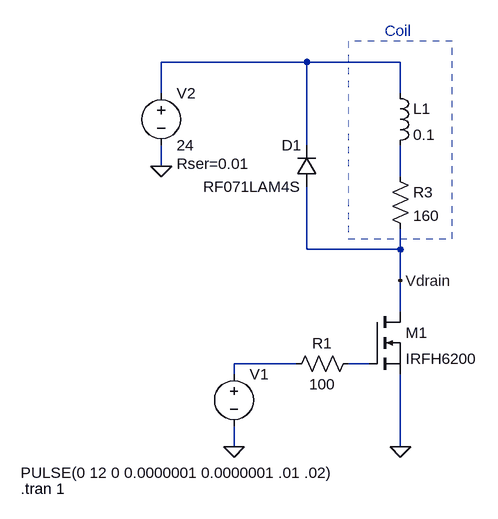
[diagram p0: schematic diode.asc]
diode.asc, the LTspice schematic file:
Version 4
SHEET 1 1004 680
WIRE 96 -48 -128 -48
WIRE 240 -48 96 -48
WIRE -128 0 -128 -48
WIRE 240 0 240 -48
WIRE 96 80 96 -48
WIRE -128 112 -128 80
WIRE 240 128 240 80
WIRE 96 240 96 144
WIRE 240 240 240 208
WIRE 240 240 96 240
WIRE 240 288 240 240
WIRE 240 336 240 288
WIRE 80 416 -16 416
WIRE 192 416 160 416
WIRE -16 432 -16 416
WIRE -16 544 -16 512
WIRE 240 544 240 432
FLAG -16 544 0
FLAG 240 544 0
FLAG -128 112 0
FLAG 240 288 Vdrain
SYMBOL nmos 192 336 R0
SYMATTR InstName M1
SYMATTR Value IRFH6200
SYMBOL res 176 400 R90
WINDOW 0 0 56 VBottom 2
WINDOW 3 32 56 VTop 2
SYMATTR InstName R1
SYMATTR Value 100
SYMBOL voltage -16 416 R0
WINDOW 3 -328 168 Left 2
WINDOW 123 0 0 Left 0
WINDOW 39 0 0 Left 0
SYMATTR Value PULSE(0 12 0 0.0000001 0.0000001 .01 .02)
SYMATTR InstName V1
SYMBOL ind 224 -16 R0
SYMATTR InstName L1
SYMATTR Value 0.1
SYMBOL voltage -128 -16 R0
WINDOW 123 0 0 Left 0
WINDOW 39 24 124 Left 2
SYMATTR SpiceLine Rser=0.01
SYMATTR InstName V2
SYMATTR Value 24
SYMBOL res 224 112 R0
SYMATTR InstName R3
SYMATTR Value 160
SYMBOL diode 112 144 R180
WINDOW 0 24 64 Left 2
WINDOW 3 24 0 Left 2
SYMATTR InstName D1
SYMATTR Value RF071LAM4S
TEXT -344 608 Left 2 !.tran 1
TEXT 216 -96 Left 2 ;Coil
LINE Normal 320 -80 160 -80 2
LINE Normal 320 224 320 -80 2
LINE Normal 160 224 320 224 2
LINE Normal 160 -80 160 224 2

The netlist it stands for:
* diode.asc
M1 Vdrain N004 0 0 IRFH6200
R1 N004 N003 100
V1 N003 0 PULSE(0 12 0 0.0000001 0.0000001 .01 .02)
L1 N001 N002 0.1
V2 N001 0 24 Rser=0.01
R3 N002 Vdrain 160
D1 Vdrain N001 RF071LAM4S
.model D D
.lib standard.dio
.model NMOS NMOS
.model PMOS PMOS
.lib standard.mos
.tran 1
* Coil
.backanno
.end